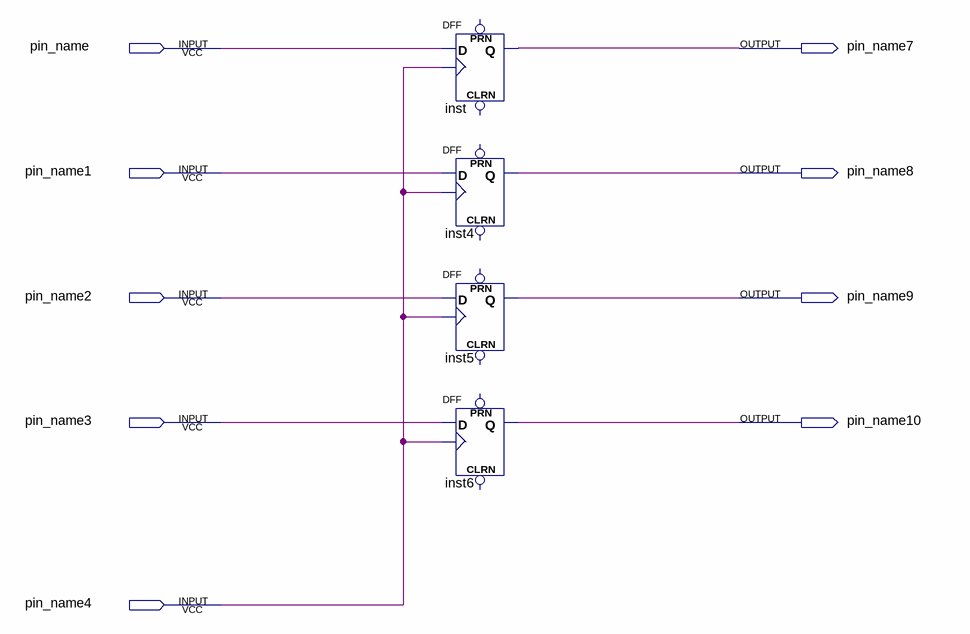
[diagram p0: schematic sheet]
// Quartus schematic registrador.bdf as structural Verilog: 4 symbols, 9 pins
module registrador (
  input  pin_name,
  input  pin_name1,
  input  pin_name2,
  input  pin_name3,
  input  pin_name4,
  output pin_name7,
  output pin_name8,
  output pin_name9,
  output pin_name10
);

  DFF inst (.CLK(pin_name4), .D(pin_name), .Q(pin_name7));  // open: CLRN, PRN
  DFF inst4 (.CLK(pin_name4), .D(pin_name1), .Q(pin_name8));  // open: CLRN, PRN
  DFF inst5 (.CLK(pin_name4), .D(pin_name2), .Q(pin_name9));  // open: CLRN, PRN
  DFF inst6 (.CLK(pin_name4), .D(pin_name3), .Q(pin_name10));  // open: CLRN, PRN
endmodule
